# Altium schematic sheet ServoConnector.SchDoc: Servo connector in/out
size A4; Organization: Altium Limited; Address1: 3 Minna Close; Address2: Belrose; Address3: NSW 2085; Address4: Australia
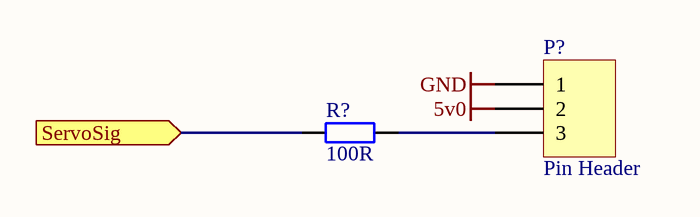
[diagram p0: ServoConnector.SchDoc]

## Parts
P?  Pin Header  [PH1x3_2.54]
R?  value 100R  [R0805]  (hidden comment: RESISTOR)

## Ports
ServoSig (in)

## Nets
5v0: P?.2
GND: P?.1
ServoSig: R?.2 ; port ServoSig
NetP?_3: P?.3 R?.1

## Notes on the sheet
- Disclaimer
  Any design and information, hardware or software  is provided on an "as-is" basis without warranty of any kind and any express or implied warranties, including, but not limited to, the implied warranties of merchantability and fitness for a particular purpose are disclaimed. In no event shall wnpd (or KeaDrone)be liable for any direct, indirect, incidental, special, exemplary, or consequential damages (including, but not limited to, procurement of substitute goods or services; loss of use, data, or profits; or business interruption) however caused and on any theory of liability, whether in contract, strict liability, or tort (including negligence or otherwise) arising in any way out of the use of this firmware, hardware, software or information, even if wnpd (or KeaDrone) has been advised by user of the possibility of such potential loss or damage. The user agrees to hold wnpd (or KeaDrone) harmless from and against any and all claims, losses, liabilities and expenses.
- Title
- Size:
- Date:
- A4
- Name:
- Time:
- Ing. W. Pietersz
- Revision:
- Sheet
- of
- WillyPietersz@gmail.com
- Contact:
- -
- www.wnpd.nl
- File:

## Library data of the parts
P? = PH1x3: Con1x3; Part Number: PH1x3; Pitch: 2.54; LatestRevision Note: Initial Release; Type: Pin Header; Number Of Pins: 3; Component Type: Standard; LatestRevision Date: 23-11-2010; Author: Willy Pietersz; Supplier 2: Farnell
R? = 100R: Manufacturer 1: Panasonic; Manufacturer 1 Part No: ERJT06J101V; Power: 0.25W; Tolerance: 0.05; LatestRevision Note: Initial Release; Published: 8-Jun-2000; LatestRevisionDate: 17-Jul-2002; LatestRevisionNote: Re-released for DXP Platform.; PackageReference: AXIAL-0.4; Publisher: Altium Limited; Part Number: 100R; Type: Film; Package: 0805; Component Type: Standard; LatestRevision Date: 30-7-2010; Author: Willy Pietersz; ROHS: Y; Supplier 2: Farnell; Supplier Part Number 2: 1618240; ComponentLink1Description: Manufacturer; ComponentLink2Description: Datasheet